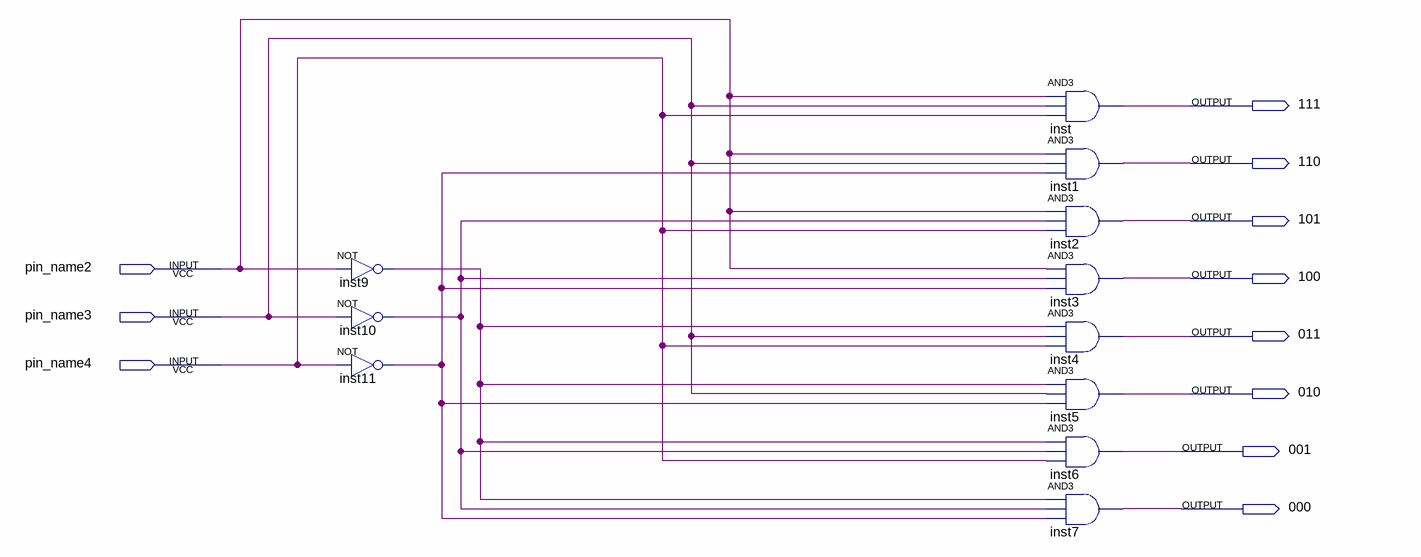
[diagram p0: schematic sheet]
// Quartus schematic decoder1.bdf as structural Verilog: 11 symbols, 11 pins
module decoder1 (
  input  pin_name2,
  input  pin_name3,
  input  pin_name4,
  output \111 ,
  output \110 ,
  output \101 ,
  output \100 ,
  output \011 ,
  output \010 ,
  output \001 ,
  output \000 
);

  wire inst9_out, inst10_out, inst11_out;

  not inst9 (inst9_out, pin_name2);
  not inst10 (inst10_out, pin_name3);
  not inst11 (inst11_out, pin_name4);
  and inst (\111 , pin_name2, pin_name3, pin_name4);
  and inst1 (\110 , pin_name2, pin_name3, inst11_out);
  and inst2 (\101 , pin_name2, inst10_out, pin_name4);
  and inst3 (\100 , pin_name2, inst10_out, inst11_out);
  and inst4 (\011 , inst9_out, pin_name3, pin_name4);
  and inst5 (\010 , inst9_out, pin_name3, inst11_out);
  and inst6 (\001 , inst9_out, inst10_out, pin_name4);
  and inst7 (\000 , inst9_out, inst10_out, inst11_out);
endmodule
